# EAGLE design v01 (EAGLE 8.4.2)
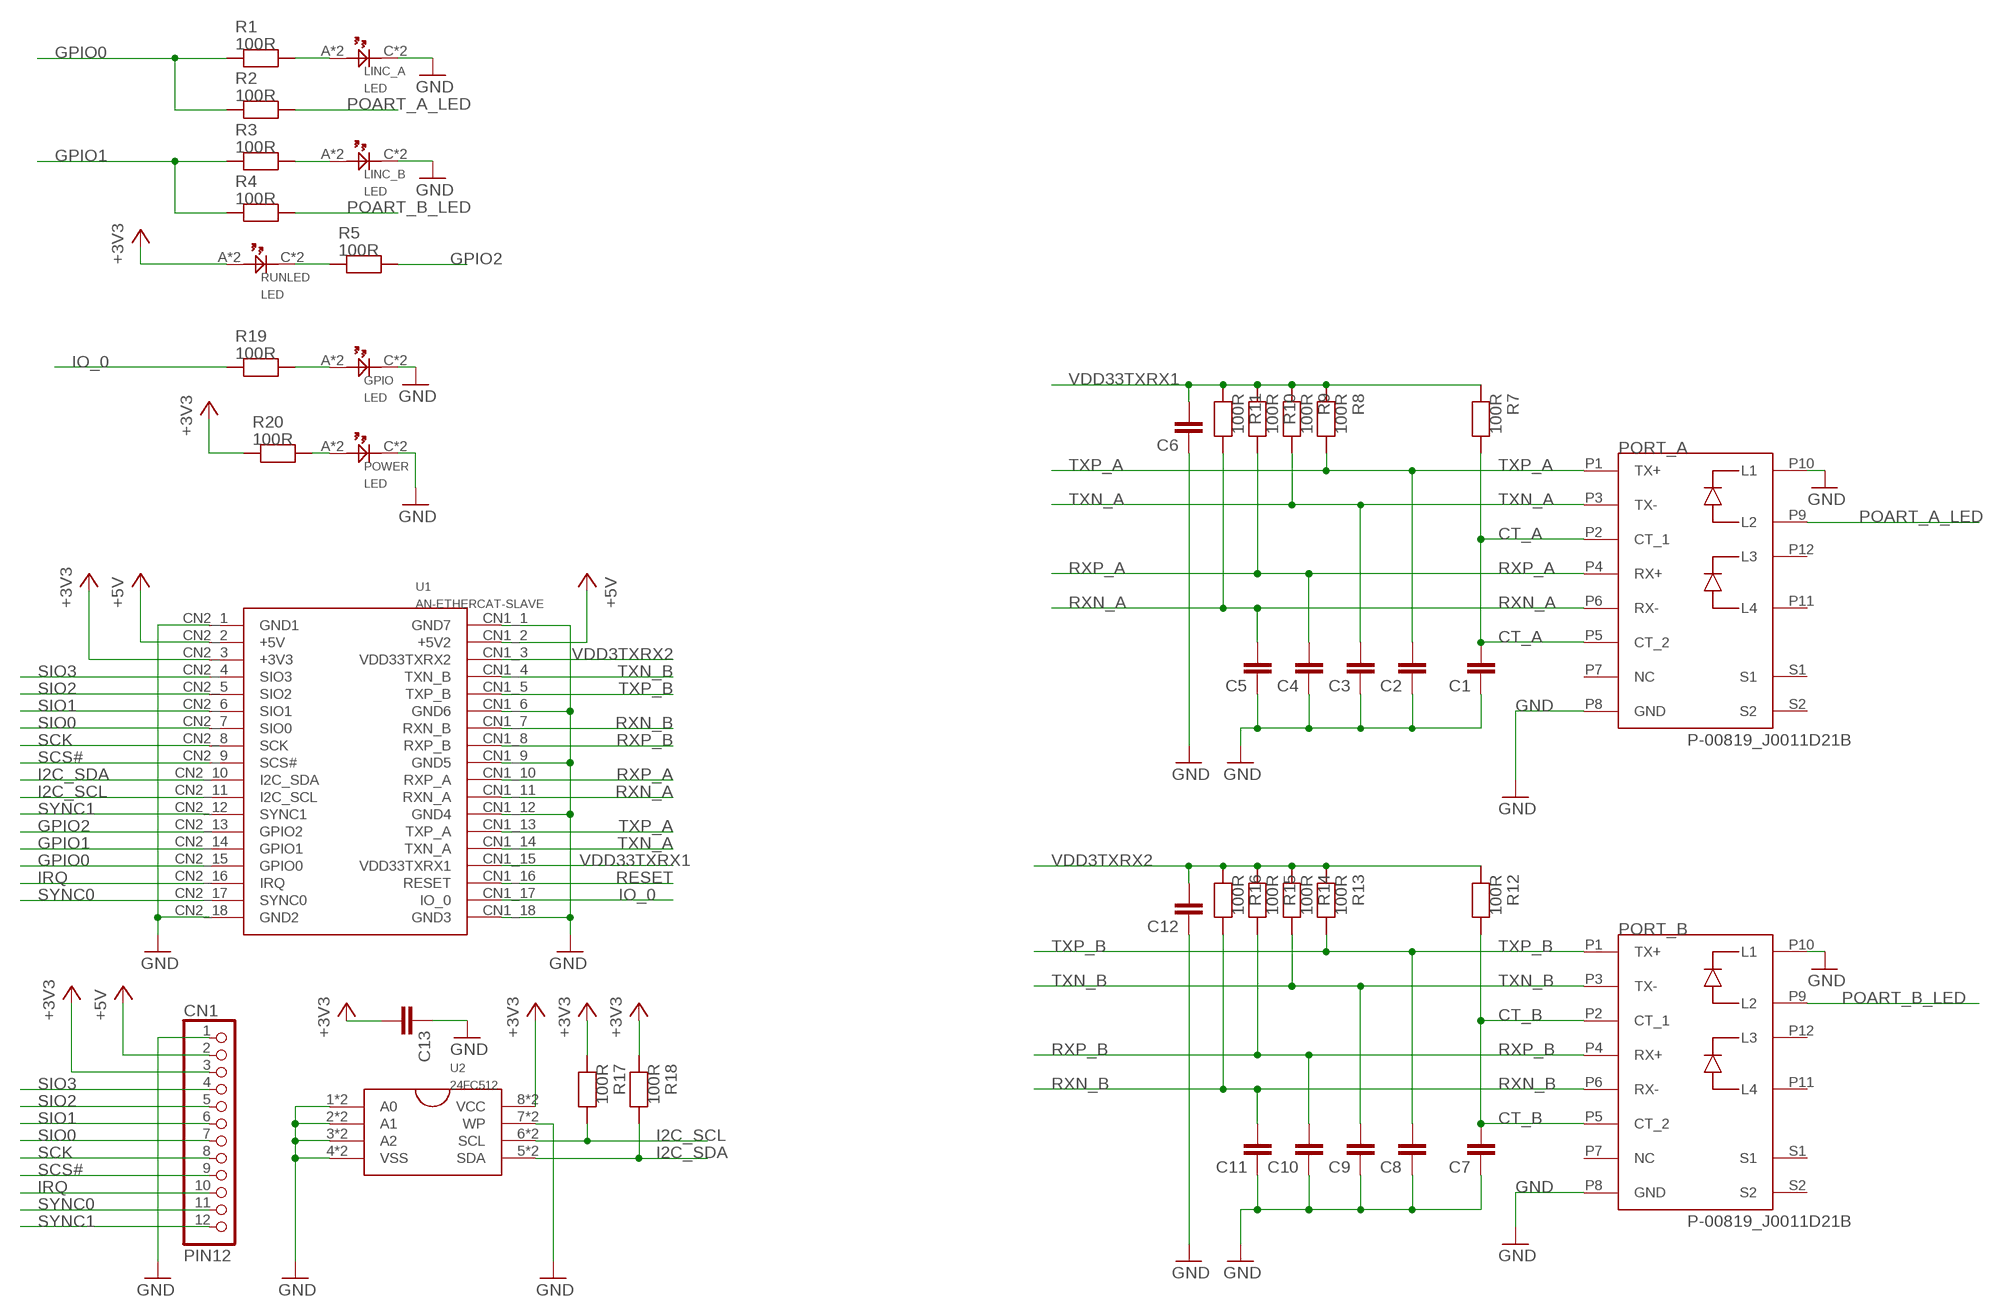
[diagram p0: schematic, sheet 1]

## Parts
C1  C_1068  [C0603]
C2  C_1068  [C0603]
C3  C_1068  [C0603]
C4  C_1068  [C0603]
C5  C_1068  [C0603]
C6  C_1068  [C0603]
C7  C_1068  [C0603]
C8  C_1068  [C0603]
C9  C_1068  [C0603]
C10  C_1068  [C0603]
C11  C_1068  [C0603]
C12  C_1068  [C0603]
C13  C_1068  [C0603]
CN1  PIN12  [PIN12]
GPIO  LED  [CHIPLED_0805]
LINC_A  LED  [CHIPLED_0805]
LINC_B  LED  [CHIPLED_0805]
PORT_A  P-00819_J0011D21B  [J0011D21B]
PORT_B  P-00819_J0011D21B  [J0011D21B]
POWER  LED  [CHIPLED_0805]
R1  100R  R_1068  [R0603]
R2  100R  R_1068  [R0603]
R3  100R  R_1068  [R0603]
R4  100R  R_1068  [R0603]
R5  100R  R_1068  [R0603]
R7  100R  R_1068  [R0603]
R8  100R  R_1068  [R0603]
R9  100R  R_1068  [R0603]
R10  100R  R_1068  [R0603]
R11  100R  R_1068  [R0603]
R12  100R  R_1068  [R0603]
R13  100R  R_1068  [R0603]
R14  100R  R_1068  [R0603]
R15  100R  R_1068  [R0603]
R16  100R  R_1068  [R0603]
R17  100R  R_1068  [R0603]
R18  100R  R_1068  [R0603]
R19  100R  R_1068  [R0603]
R20  100R  R_1068  [R0603]
RUNLED  LED  [CHIPLED_0805]
U1  AN-ETHERCAT-SLAVE  [AN-ETHERCAT-SLAVE]
U2  24FC512  [SOP8]

## Nets
+3V3: C13.2 CN1.3 R17.1 R18.1 R20.1 RUNLED.A RUNLED.DA(A) U1.CN2_3(+3V3) U2.8(VCC) U2.D8(VCC)
+5V: CN1.2 U1.CN1_2(+5V2) U1.CN2_2(+5V)
CT_A: C1.2 PORT_A.P2(CT_1) PORT_A.P5(CT_2) R7.2
CT_B: C7.2 PORT_B.P2(CT_1) PORT_B.P5(CT_2) R12.2
GND: C1.1 C2.1 C3.1 C4.1 C5.1 C6.1 C7.1 C8.1 C9.1 C10.1 C11.1 C12.1 C13.1 CN1.1 GPIO.C GPIO.DC(C) LINC_A.C LINC_A.DC(C) LINC_B.C LINC_B.DC(C) PORT_A.P8(GND) PORT_A.P10(L1) PORT_B.P8(GND) PORT_B.P10(L1) POWER.C POWER.DC(C) U1.CN1_1(GND7) U1.CN1_6(GND6) U1.CN1_9(GND5) U1.CN1_12(GND4) U1.CN1_18(GND3) U1.CN2_1(GND1) U1.CN2_18(GND2) U2.1(A0) U2.2(A1) U2.3(A2) U2.4(VSS) U2.7(WP) U2.D1(A0) U2.D2(A1) U2.D3(A2) U2.D4(VSS) U2.D7(WP)
GPIO0: R1.1 R2.1 U1.CN2_15(GPIO0)
GPIO1: R3.1 R4.1 U1.CN2_14(GPIO1)
GPIO2: R5.2 U1.CN2_13(GPIO2)
I2C_SCL: R17.2 U1.CN2_11(I2C_SCL) U2.6(SCL) U2.D6(SCL)
I2C_SDA: R18.2 U1.CN2_10(I2C_SDA) U2.5(SDA) U2.D5(SDA)
IO_0: R19.1 U1.CN1_17(IO_0)
IRQ: CN1.10 U1.CN2_16(IRQ)
N$1: LINC_A.A LINC_A.DA(A) R1.2
N$2: LINC_B.A LINC_B.DA(A) R3.2
N$3: R5.1 RUNLED.C RUNLED.DC(C)
N$7: GPIO.A GPIO.DA(A) R19.2
N$8: POWER.A POWER.DA(A) R20.2
POART_A_LED: PORT_A.P9(L2) R2.2
POART_B_LED: PORT_B.P9(L2) R4.2
RESET: U1.CN1_16(RESET)
RXN_A: C5.2 PORT_A.P6(RX-) R11.2 U1.CN1_11(RXN_A)
RXN_B: C11.2 PORT_B.P6(RX-) R16.2 U1.CN1_7(RXN_B)
RXP_A: C4.2 PORT_A.P4(RX+) R10.2 U1.CN1_10(RXP_A)
RXP_B: C10.2 PORT_B.P4(RX+) R15.2 U1.CN1_8(RXP_B)
SCK: CN1.8 U1.CN2_8(SCK)
SCS#: CN1.9 U1.CN2_9(SCS#)
SIO0: CN1.7 U1.CN2_7(SIO0)
SIO1: CN1.6 U1.CN2_6(SIO1)
SIO2: CN1.5 U1.CN2_5(SIO2)
SIO3: CN1.4 U1.CN2_4(SIO3)
SYNC0: CN1.11 U1.CN2_17(SYNC0)
SYNC1: CN1.12 U1.CN2_12(SYNC1)
TXN_A: C3.2 PORT_A.P3(TX-) R9.2 U1.CN1_14(TXN_A)
TXN_B: C9.2 PORT_B.P3(TX-) R14.2 U1.CN1_4(TXN_B)
TXP_A: C2.2 PORT_A.P1(TX+) R8.2 U1.CN1_13(TXP_A)
TXP_B: C8.2 PORT_B.P1(TX+) R13.2 U1.CN1_5(TXP_B)
VDD3TXRX2: C12.2 R12.1 R13.1 R14.1 R15.1 R16.1 U1.CN1_3(VDD33TXRX2)
VDD33TXRX1: C6.2 R7.1 R8.1 R9.1 R10.1 R11.1 U1.CN1_15(VDD33TXRX1)
Unconnected: PORT_A.P7(NC) PORT_A.P11(L4) PORT_A.P12(L3) PORT_A.S1 PORT_A.S2 PORT_B.P7(NC) PORT_B.P11(L4) PORT_B.P12(L3) PORT_B.S1 PORT_B.S2

## Library data of the parts
C1-C13 = LAN9252:C_1068
CN1 = LAN9252:PIN12
GPIO LINC_A LINC_B POWER RUNLED = LAN9252:LED
PORT_A PORT_B = LAN9252:P-00819_J0011D21B
R1-R5 R7-R20 = MyPacklbr:R_1068
U1 = LAN9252:AN-ETHERCAT-SLAVE
U2 = LAN9252:24FC512

## Board
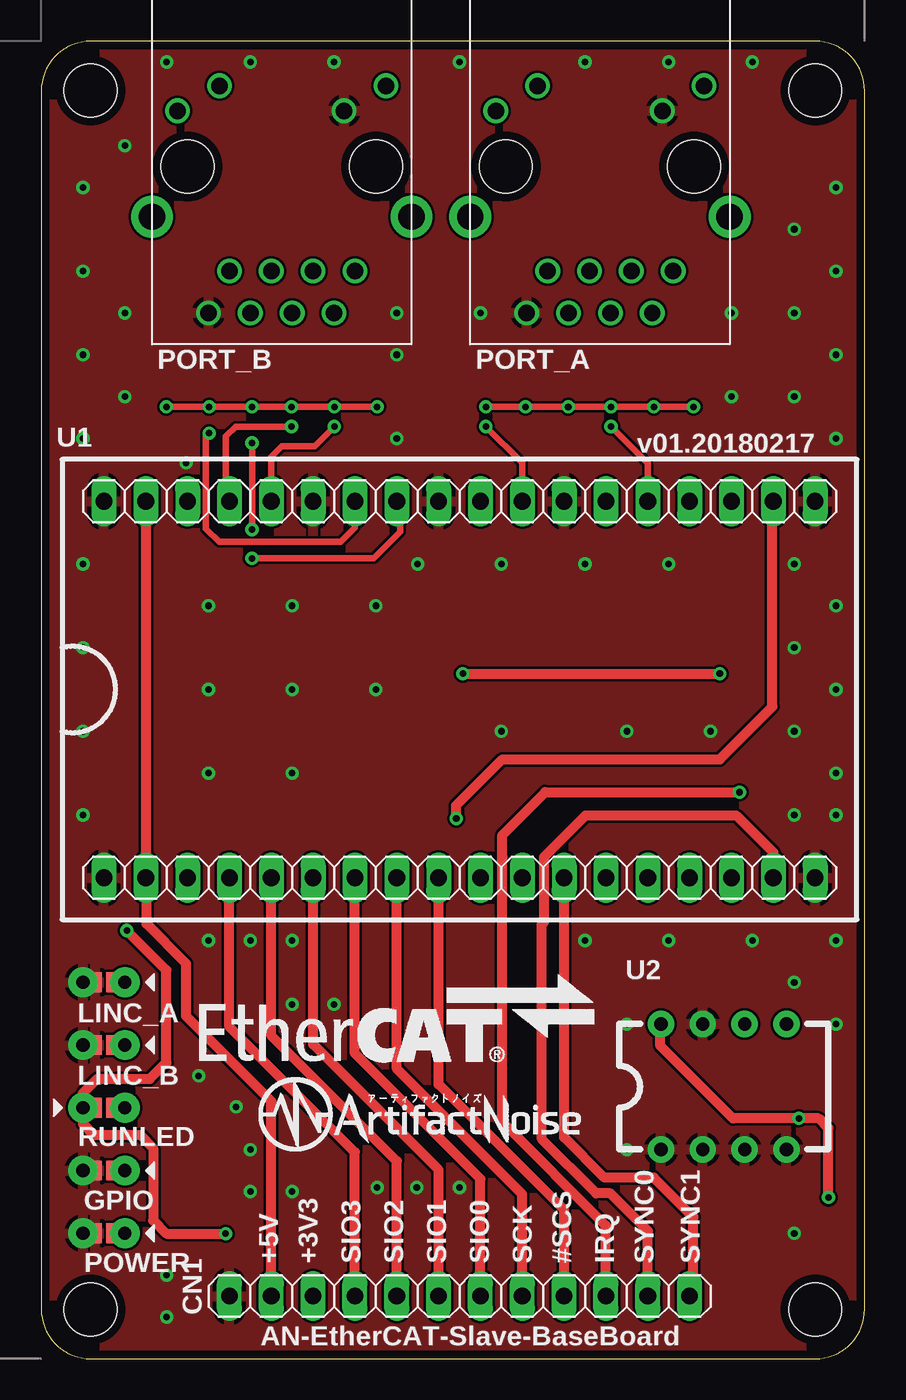
[diagram p1: board, top side]
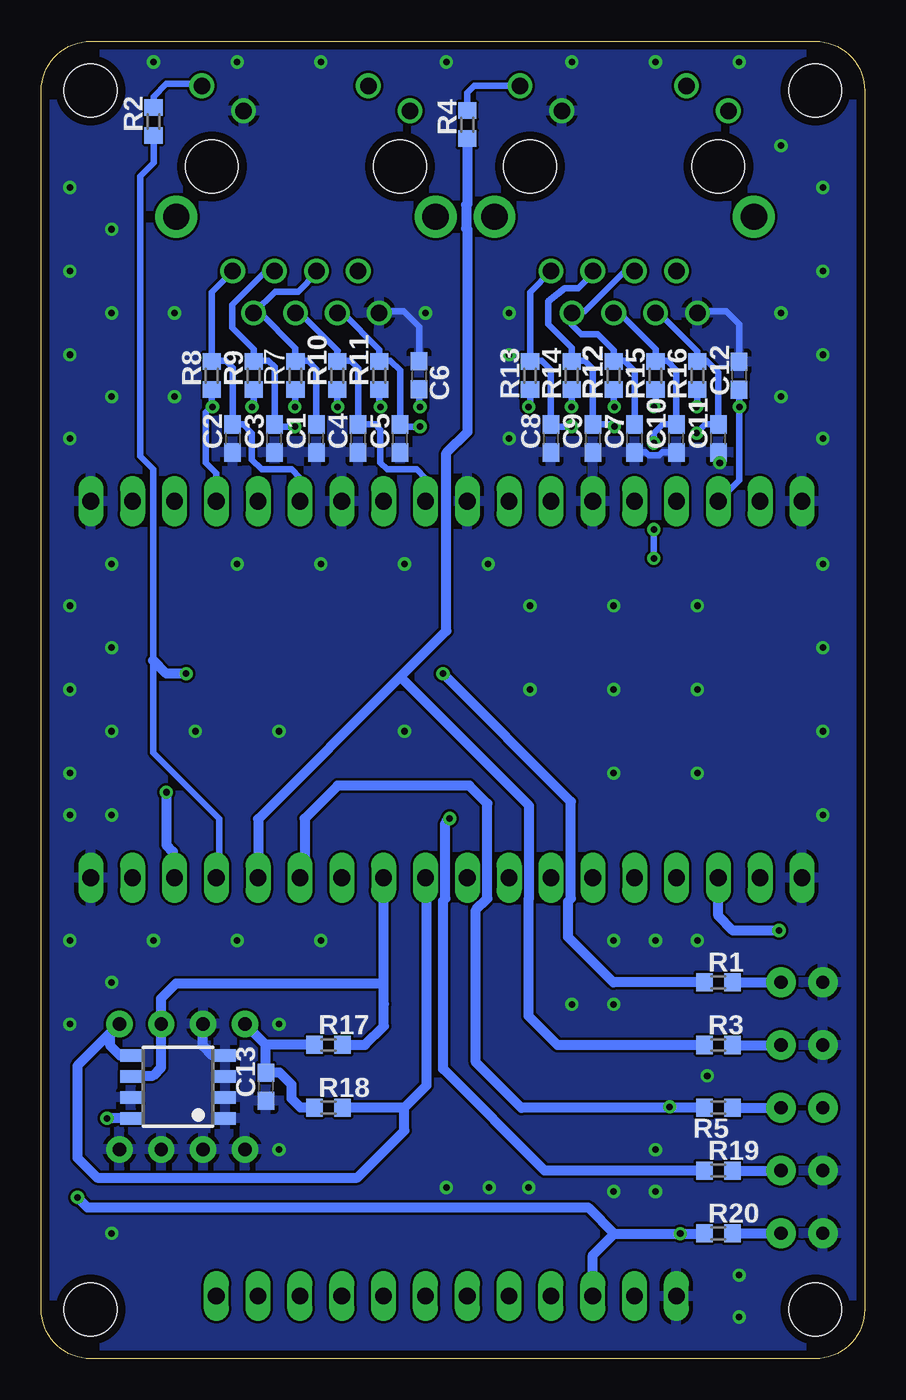
[diagram p2: board, bottom side, seen from below]

Size 50 x 80 mm. Coordinates in mm from the lower left corner, seen from the top.
Outline: 0,77 0,3 arc90 3,0 47,0 arc90 50,3 50,77 arc90 47,80 3,80 arc90 0,77
Copper layers (1*16): Top 0.035mm / dielectric 1.6mm / Bottom 0.035mm
Design rules "Elecrow_2-layer_PCB_eagle_rule": minimum track width 6mil, minimum drill 12mil, track to track 6mil, track to pad 6mil, pad to pad 6mil, via to via 8mil, smd to smd 0mil, copper to edge 20mil, drill to drill 10mil, minimum pad ring 6mil, minimum via ring 6mil, stop-mask expansion 0mil, vias tented up to drill 100mil, thermal gap 10mil
Holes 3.2 mm at 3,77 47,77 3,3 47,3

### Footprints (pad centres in the part's own frame; a part is rotated, then mirrored left to right if it is on the bottom)
C0603 = smd 1.1 x 1: 1 -0.85,0; 2 0.85,0
PIN12 = drill 1.016 long: 1 -13.97,0; 2 -11.43,0; 3 -8.89,0; 4 -6.35,0; 5 -3.81,0; 6 -1.27,0; 7 1.27,0; 8 3.81,0; 9 6.35,0; 10 8.89,0; 11 11.43,0; 12 13.97,0
CHIPLED_0805 = smd 1.2 x 0.8: A 0,-1.8; C 0,-0.74 | drill 0.8 pad 1.8: DA 0,-2.54; DC 0,0
J0011D21B = drill 1: P1 8.89,2.54; P2 7.62,0; P3 6.35,2.54; P4 5.08,0; P5 3.81,2.54; P6 2.54,0; P7 1.27,2.54; P8 0,0; P9 10.77,13.79; P10 8.23,12.27; P11 0.66,13.79; P12 -1.88,12.27 | drill 1.6 pad 2.54: S1 -3.43,5.84; S2 12.32,5.84 | hole 3.2: 10.16,8.89; -1.27,8.89
R0603 = smd 1 x 1.1: 1 -0.85,0; 2 0.85,0
AN-ETHERCAT-SLAVE = drill 1.016 long: CN1_1 25.4,21.59; CN1_2 25.4,19.05; CN1_3 25.4,16.51; CN1_4 25.4,13.97; CN1_5 25.4,11.43; CN1_6 25.4,8.89; CN1_7 25.4,6.35; CN1_8 25.4,3.81; CN1_9 25.4,1.27; CN1_10 25.4,-1.27; CN1_11 25.4,-3.81; CN1_12 25.4,-6.35; CN1_13 25.4,-8.89; CN1_14 25.4,-11.43; CN1_15 25.4,-13.97; CN1_16 25.4,-16.51; CN1_17 25.4,-19.05; CN1_18 25.4,-21.59; CN2_1 2.54,21.59; CN2_2 2.54,19.05; CN2_3 2.54,16.51; CN2_4 2.54,13.97; CN2_5 2.54,11.43; CN2_6 2.54,8.89; CN2_7 2.54,6.35; CN2_8 2.54,3.81; CN2_9 2.54,1.27; CN2_10 2.54,-1.27; CN2_11 2.54,-3.81; CN2_12 2.54,-6.35; CN2_13 2.54,-8.89; CN2_14 2.54,-11.43; CN2_15 2.54,-13.97; CN2_16 2.54,-16.51; CN2_17 2.54,-19.05; CN2_18 2.54,-21.59
SOP8 = smd 1.27 x 0.76 bottom: 1 -3.875,-3.189; 2 -3.875,-1.919; 3 -3.875,-0.649; 4 -3.875,0.621; 5 1.845,0.621; 6 1.845,-0.649; 7 1.845,-1.919; 8 1.845,-3.189 | drill 0.8 pad 1.6: D1 -5.08,-5.08; D2 -2.54,-5.08; D3 0,-5.08; D4 2.54,-5.08; D5 2.54,2.54; D6 0,2.54; D7 -2.54,2.54; D8 -5.08,2.54

### Placement (x,y rotation side)
C1  33.29,55.88 90 bottom
C2  38.37,55.88 90 bottom
C3  35.83,55.88 90 bottom
C4  30.75,55.88 90 bottom
C5  28.21,55.88 90 bottom
C6  27.06,59.71 270 bottom
C7  13.97,55.88 90 bottom
C8  19.05,55.88 90 bottom
C9  16.51,55.88 90 bottom
C10  11.43,55.88 90 bottom
C11  8.89,55.88 90 bottom
C12  7.62,59.69 270 bottom
C13  36.36,16.52 90 bottom
CN1  25.4,3.81 0 top
GPIO  2.54,11.43 90 top
LINC_A  2.54,22.86 90 top
LINC_B  2.54,19.05 90 top
PORT_A  29.48,63.5 0 top
PORT_B  10.16,63.5 0 top
POWER  2.54,7.62 90 top
R1  8.89,22.86 0 bottom
R2  43.18,75.13 90 bottom
R3  8.89,19.05 0 bottom
R4  24.13,74.93 90 bottom
R5  8.89,15.24 180 bottom
R7  34.56,59.69 90 bottom
R8  39.64,59.69 90 bottom
R9  37.1,59.69 90 bottom
R10  32.02,59.69 90 bottom
R11  29.48,59.69 90 bottom
R12  15.24,59.69 90 bottom
R13  20.32,59.69 90 bottom
R14  17.78,59.69 90 bottom
R15  12.7,59.69 90 bottom
R16  10.16,59.69 90 bottom
R17  32.55,19.06 0 bottom
R18  32.55,15.25 0 bottom
R19  8.89,11.43 0 bottom
R20  8.89,7.62 0 bottom
RUNLED  5.08,15.24 270 top
U1  25.4,26.67 90 top
U2  42.71,17.79 0 top
U$1  [ETHERCAT_LOGO]  9.6,18 0 top
U$2  [AN-LOGO2]  13.2,12.6 0 top

### Tracks (layer width: path | path; a pad name or v marks a point on that pad's centre or on a via)
+3V3  (via drill 0.4 pad 0.8)
  Top 0.6: U2.D8 37.6,20.3 37.6,19 42,14.6 v46,14.6 47.2,14.6 47.8,14 v47.8,9.8 | RUNLED.DA 2.54,14.26 3.2,13.6 6,13.6 6.8,12.8 6.8,8.4 7.6,7.6 v11.2,7.6 | RUNLED.DA RUNLED.A | RUNLED.DA 2.54,16.14 3.4,17 6.6,17 7.6,18 7.6,23.6 v5.2,26
  Bottom 0.6: U2.8 v46,14.6 | 36.36,19.06 C13.2 35.52,17.37 34.8,16.65 34.8,15.8 34.25,15.25 R18.1 | 36.36,19.06 U2.D8 | R17.1 36.36,19.06 | v47.8,9.8 47.2,9.2 16.8,9.2 15.2,7.6 | R20.1 9.76,7.6 v11.2,7.6 15.2,7.6 | CN1.3 16.51,6.29 15.2,7.6 | v5.2,26 8,26 8.89,26.89 U1.CN2_3
+5V
  Top 0.6: CN1.2 13.97,15.63 8.8,20.8 8.8,24 6.4,26.4 6.4,29.16 U1.CN2_2 U1.CN1_2
CT_A
  Bottom 0.4: PORT_A.P5 33.29,65.91 34.4,64.8 35.8,64.8 PORT_A.P2 36.7,63.5 34.56,61.36 R7.2 34.5,60.6 33.8,60.6 33.29,60.09 C1.2
CT_B
  Bottom 0.4: PORT_B.P5 14.56,66.04 17,63.6 17.68,63.6 PORT_B.P2 17.78,62.78 17.2,62.2 16.2,62.2 15.24,61.24 R12.2 15.18,60.6 14.6,60.6 13.97,59.97 C7.2
GND  (via drill 0.4 pad 0.8)
  Top 0.6: LINC_A.C LINC_A.DC | LINC_B.C LINC_B.DC | GPIO.C GPIO.DC
  Bottom 0.4: C12.1 7.62,62.82 8.4,63.6 10.06,63.6 PORT_B.P8 | C6.1 27.06,62.66 28,63.6 29.38,63.6 PORT_A.P8 | C10.1 12.31,55.03 12.49,54.85 13.11,54.85 13.29,55.03 C7.1
  Bottom 0.6: U2.4 39.61,18.41 40.2,19 40.2,20.3 U2.D7 | C11.1 8.89,54.49 v8.8,54.4
  other vias: 7.62,2.54 7.62,5.08 12.7,10.16 12.7,12.7 11.84,15.3 15.24,10.16 9.56,17.18 15.24,21.52 17.78,21.52 10.16,25.4 12.7,25.4 15.24,25.4 33.02,25.4 38.1,25.4 43.18,25.4 48.26,25.4 48.26,20.32 45.72,22.86 35.56,20.32 35.56,12.7 45.72,7.62 45.72,33.02 48.26,33.02 10.16,40.64 10.16,35.56 10.16,45.72 15.24,35.56 15.24,40.64 15.24,45.72 20.32,40.64 20.32,45.72 22.86,48.26 27.94,48.26 33.02,48.26 38.1,48.26 35.56,38.1 40.64,38.1 27.94,38.1 2.54,38.1 2.54,33.02 2.54,43.18 2.54,48.26 45.72,48.26 48.26,45.72 45.72,43.18 48.26,40.64 45.72,38.1 48.26,35.56 48.26,55.88 48.26,60.96 48.26,66.04 48.26,71.12 45.72,68.58 45.72,63.5 45.72,58.42 2.54,55.88 5.08,58.42 2.54,60.96 5.08,63.5 2.54,66.04 2.54,71.12 5.08,73.66 12.7,78.74 7.62,78.74 17.78,78.74 25.4,78.74 33.02,78.74 38.1,78.74 43.18,78.74 21.59,63.5 21.59,60.96 21.59,55.88 26.67,63.5 41.91,63.5 41.91,58.42 20.4,10.4 22.8,10.4 25.4,10.4
  pour Top: 0,0 50,0 50,80 0,80
  pour Bottom: 0,0 50,0 50,80 0,80
GPIO0  (via drill 0.4 pad 0.8)
  Top 0.6: v25.6,41.6 v41.2,41.6
  Bottom 0.4: R2.1 43.18,72.62 44,71.8 44,54.8 43.2,54 43.2,42.4 43.2,36.8 39.2,32.8 39.2,29.38 U1.CN2_15
  Bottom 0.6: R1.1 15.26,22.86 18,25.6 18,27.78 17.84,27.95 17.84,33.84 v25.6,41.6 | v41.2,41.6 42.4,41.6 43.2,42.4
GPIO1
  Bottom 0.4: 36.8,29.24 U1.CN2_14
  Bottom 0.6: R3.1 18.65,19.05 20.4,20.8 20.4,27.92 20.38,27.95 20.38,33.58 28.2,41.4 | U1.CN2_14 36.83,32.77 28.2,41.4 | 28.2,41.4 25.4,44.2 25.4,55 24.13,56.27 24.13,68.55 24.2,68.63 24.2,70.05 24.13,70.13 R4.1
GPIO2
  Bottom 0.6: R5.2 20.84,15.24 23.6,18 23.6,27.26 22.92,27.95 22.92,33.72 24,34.8 32,34.8 34,32.8 34,29.5 U1.CN2_13
I2C_SCL
  Bottom 0.6: U2.6 44.5,17.2 43.2,17.2 42.71,17.69 U2.D6 42.71,21.89 41.8,22.8 29.41,22.8 29.21,22.6 | 29.21,22.6 U1.CN2_11 | 29.21,22.6 29.21,21.55 29.2,21.54 29.2,20.2 30.34,19.06 R17.2
I2C_SDA
  Top 0.6: 26.6,29.14 U1.CN2_10
  Bottom 0.6: U2.5 45.21,18.41 45.8,19 45.8,19.78 U2.D5 47.8,17.78 47.8,12.2 46.6,11 30.8,11 27.95,13.85 27.95,15.25 | 27.95,15.25 R18.2 | 27.95,15.25 26.6,16.6 26.6,29.14 U1.CN2_10
IO_0  (via drill 0.4 pad 0.8)
  Top 0.6: v25.2,32.8 25.2,33.6 28,36.4 41.2,36.4 44.4,39.6 44.4,52.02 U1.CN1_17
  Bottom 0.6: R19.1 19.43,11.43 25.6,17.6 25.6,27.8 25.46,27.95 25.46,32.54 v25.2,32.8
IRQ  (via drill 0.4 pad 0.8)
  Top 0.6: v42.4,34.4 30.6,34.4 28,31.8 28,30.48 28,14.38 34.29,8.09 CN1.10
  Bottom 0.6: v42.4,34.4 42.4,31.2 42,30.8 42,29.3 U1.CN2_16
N$1
  Top 0.6: LINC_A.DA LINC_A.A
  Bottom 0.6: R1.2 LINC_A.DA
N$2
  Bottom 0.6: R3.2 LINC_B.DA
N$3
  Top 0.6: RUNLED.DC RUNLED.C
  Bottom 0.6: R5.1 RUNLED.DC
N$7
  Bottom 0.6: R19.2 GPIO.DA
N$8
  Bottom 0.6: R20.2 POWER.DA
POART_A_LED
  Bottom 0.4: R2.2 43.18,76.62 42.4,77.4 40.36,77.4 PORT_A.P9
POART_B_LED
  Bottom 0.4: R4.2 24.13,76.87 23.71,77.29 PORT_B.P9
RXN_A  (via drill 0.4 pad 0.8)
  Top 0.4: U1.CN1_11 29.21,54.39 v27,56.6
  Bottom 0.4: 29.48,60.6 R11.2 | 29.48,60.6 29.48,61.28 31.7,63.5 PORT_A.P6 | 29.48,60.6 28.8,60.6 28.21,60.01 C5.2 28.08,56.6 v27,56.6
RXN_B  (via drill 0.4 pad 0.8)
  Top 0.4: U1.CN1_7 19.05,50.45 18.2,49.6 10.8,49.6 10,50.4 10,50.84 10,50.85 10,56 v10.2,56.2
  Bottom 0.4: 10.16,60.6 R16.2 | 10.16,60.6 10.16,61.16 12.5,63.5 PORT_B.P6 | 10.16,60.6 9.6,60.6 8.89,59.89 C11.2 9.67,56.73 v10.2,56.2
RXP_A
  Bottom 0.4: 32.02,60.6 R10.2 | 32.02,60.6 32.02,61.18 32,61.2 34.3,63.5 PORT_A.P4 | 32.02,60.6 31.2,60.6 30.75,60.15 C4.2 29.73,56.73 29.4,56.4 29.4,54.4 29,54 27.2,54 26.67,53.47 U1.CN1_10
RXP_B  (via drill 0.4 pad 0.8)
  Top 0.4: v12.8,48.6 20.2,48.6 21.8,50.2 21.8,51.86 U1.CN1_8 | v12.8,55.6 v12.8,50.35
  Bottom 0.4: 12.7,60.6 R15.2 | 12.7,60.6 12.7,61.3 14.9,63.5 PORT_B.P4 | 12.7,60.6 12,60.6 11.43,60.03 C10.2 12.27,56.73 12.8,56.2 v12.8,55.6 | v12.8,50.35 v12.8,48.6
SCK
  Top 0.6: CN1.8 29.2,10 21.6,17.6 U1.CN2_8
SCS#
  Top 0.6: CN1.9 31.75,9.05 24.13,16.67 U1.CN2_9
SIO0
  Top 0.6: CN1.7 26.67,10.93 19.05,18.55 U1.CN2_7
SIO1
  Top 0.6: CN1.6 24.13,11.47 16.51,19.09 U1.CN2_6
SIO2
  Top 0.6: CN1.5 21.59,12.01 13.97,19.63 U1.CN2_5
SIO3
  Top 0.6: CN1.4 19.05,12.55 11.43,20.17 U1.CN2_4
SYNC0
  Top 0.6: U1.CN2_17 44.45,30.75 42.2,33 33.06,33 30.54,30.48 30.54,26.54 30.4,26.4 30.4,13.34 33.69,10.05 34.55,10.05 36.83,7.77 CN1.11
SYNC1
  Top 0.6: CN1.12 39.6,4.04 39.6,8.6 37.2,11 34.2,11 31.75,13.45 U1.CN2_12
TXN_A  (via drill 0.4 pad 0.8)
  Top 0.4: U1.CN1_14 36.83,54.37 v34.6,56.6
  Bottom 0.4: 37.1,60.6 R9.2 | 37.1,60.6 37.1,61.3 38.4,62.6 38.4,64 36.36,66.04 PORT_A.P3 | 37.1,60.6 36.2,60.6 35.83,60.23 C3.2 35.7,56.6 v34.6,56.6
TXN_B  (via drill 0.4 pad 0.8)
  Top 0.4: v15.2,56.6 11.8,56.6 11.2,56 11.2,52.3 U1.CN1_4
  Bottom 0.4: PORT_B.P3 16.51,65.89 17.4,65 18.2,65 19.2,64.2 19.2,62.8 17.78,61.38 R14.2 17.72,60.6 17,60.6 16.51,60.11 C9.2 15.33,56.73 v15.2,56.6
TXP_A
  Bottom 0.4: 39.64,60.6 R8.2 | 39.64,60.6 39.64,64.77 PORT_A.P1 | 39.64,60.6 38.8,60.6 38.37,60.17 C2.2 37.73,56.73 37.2,56.2 37.2,54.6 36.6,54 34.8,54 34.29,53.49 U1.CN1_13
TXP_B  (via drill 0.4 pad 0.8)
  Top 0.4: U1.CN1_5 13.97,54.77 14.6,55.4 16.6,55.4 v17.8,56.6
  Bottom 0.4: 20.32,60.6 R13.2 | 20.32,60.6 20.32,64.77 PORT_B.P1 | 20.32,60.6 19.6,60.6 19.05,60.05 C8.2 18.92,56.6 v17.8,56.6
VDD3TXRX2  (via drill 0.4 pad 0.8)
  Top 0.4: v20.4,57.8 v17.8,57.8 v15.2,57.8 v12.8,57.8 v10.2,57.8 v7.6,57.8
  Bottom 0.4: 7.62,57.82 C12.2 | 7.62,57.82 v7.6,57.8 | R16.1 10.16,57.84 v10.2,57.8 | R15.1 12.7,57.9 v12.8,57.8 | R12.1 15.24,57.84 v15.2,57.8 | R14.1 17.78,57.82 v17.8,57.8 | R13.1 20.32,57.88 v20.4,57.8 | U1.CN1_3 7.62,53.34 7.62,57.82
VDD33TXRX1  (via drill 0.4 pad 0.8)
  Top 0.4: v27,57.8 v29.4,57.8 v32,57.8 v34.6,57.8 v37.2,57.8 v39.6,57.8
  Bottom 0.4: C6.2 27.06,57.86 v27,57.8 | R11.1 29.48,57.88 v29.4,57.8 | R10.1 32.02,57.82 v32,57.8 | R7.1 34.56,57.84 v34.6,57.8 | R9.1 37.1,57.9 v37.2,57.8 | 39.64,57.84 R8.1 | 39.64,57.84 v39.6,57.8 | U1.CN1_15 39.37,53.77 40,54.4 40,57.48 39.64,57.84

### Text on the board
tPlace: v01.20180217 | +5V | +3V3 | SIO3 | SIO2 | SIO1 | SIO0 | SCK | #SCS | IRQ | SYNC0 | SYNC1 | AN-EtherCAT-Slave-BaseBoard